# EAGLE design WIFI V 1.0 (EAGLE 7.6.0)
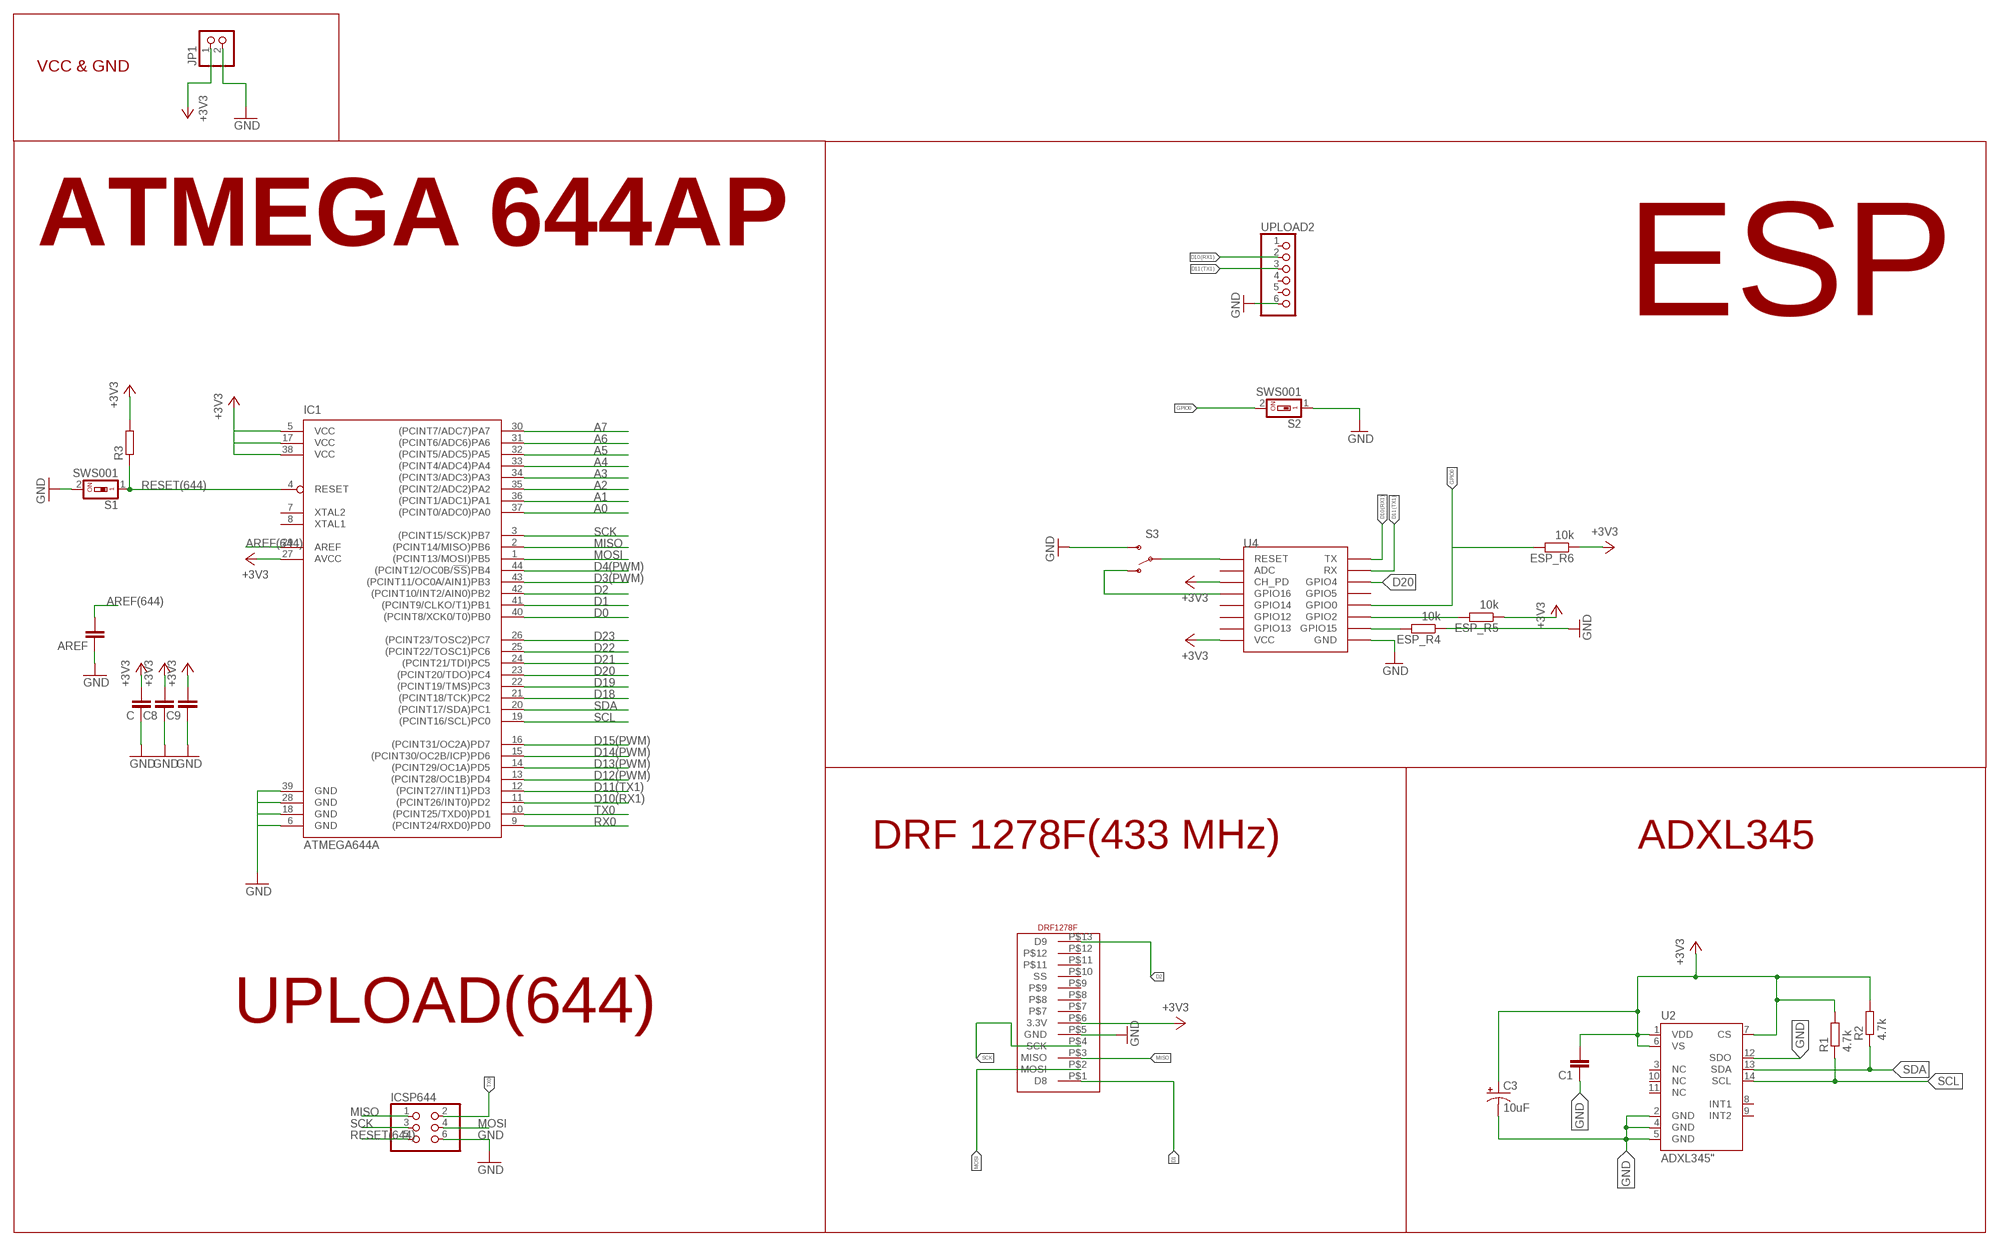
[diagram p0: schematic, sheet 1]

## Parts
AREF  100nF  C-EUC0805  [C0805]
C  22 uF  C-EUC0805  [C0805]
C1  0.1uF  C-EUC0805  [C0805]
C3  10uF  CAP_POL1206  [EIA3216]
C8  100nF  C-EUC0805  [C0805]
C9  100nF  C-EUC0805  [C0805]
ESP_R4  10k  R-EU_R0805  [R0805]
ESP_R5  10k  R-EU_R0805  [R0805]
ESP_R6  10k  R-EU_R0805  [R0805]
IC1  ATMEGA644A  [TQFP44]
ICSP644  PINHD-2X3  [2X03]
JP1  PINHD-1X2  [1X02]
R1  4.7k  R-EU_R0805  [R0805]
R2  4.7k  R-EU_R0805  [R0805]
R3  R-EU_R0805  [R0805]
S1  SWS001  [SMS-001]
S2  SWS001  [SMS-001]
S3  SWITCH-SPDTPTH  [SWITCH-SPDT]
U2  ADXL345"  [ADXL3451:1]
U4  ESP12SMD  [ESP12-SMD]
U$1  DRF1278F  [DIP13]
UPLOAD2  PINHD-1X6  [1X06]

## Nets
+3V3: C1.2 C3.A(+) C8.2 C9.2 C.2 ESP_R5.1 ESP_R6.1 IC1.5(VCC) IC1.17(VCC) IC1.27(AVCC) IC1.38(VCC) JP1.1 R1.2 R2.2 R3.2 U2.1(VDD) U2.6(VS) U2.7(CS) U4.CH_PD U4.VCC U$1.P$6(3.3V)
A0: IC1.37((PCINT0/ADC0)PA0)
A1: IC1.36((PCINT1/ADC1)PA1)
A2: IC1.35((PCINT2/ADC2)PA2)
A3: IC1.34((PCINT3/ADC3)PA3)
A4: IC1.33((PCINT4/ADC4)PA4)
A5: IC1.32((PCINT5/ADC5)PA5)
A6: IC1.31((PCINT6/ADC6)PA6)
A7: IC1.30((PCINT7/ADC7)PA7)
AREF(644): AREF.2 IC1.29(AREF)
D0: IC1.40((PCINT8/XCK0/T0)PB0)
D1: IC1.41((PCINT9/CLKO/T1)PB1) U$1.P$1(D8)
D2: IC1.42((PCINT10/INT2/AIN0)PB2) U$1.P$13(D9)
D3(PWM): IC1.43((PCINT11/OC0A/AIN1)PB3)
D4(PWM): IC1.44((PCINT12/OC0B/!SS!)PB4)
D10(RX1): IC1.11((PCINT26/INT0)PD2) U4.TXD0(TX) UPLOAD2.2
D11(TX1): IC1.12((PCINT27/INT1)PD3) U4.RXD0(RX) UPLOAD2.3
D12(PWM): IC1.13((PCINT28/OC1B)PD4)
D13(PWM): IC1.14((PCINT29/OC1A)PD5)
D14(PWM): IC1.15((PCINT30/OC2B/ICP)PD6)
D15(PWM): IC1.16((PCINT31/OC2A)PD7)
D18: IC1.21((PCINT18/TCK)PC2)
D19: IC1.22((PCINT19/TMS)PC3)
D20: IC1.23((PCINT20/TDO)PC4) U4.GPIO4
D21: IC1.24((PCINT21/TDI)PC5)
D22: IC1.25((PCINT22/TOSC1)PC6)
D23: IC1.26((PCINT23/TOSC2)PC7)
GND: AREF.1 C1.1 C3.C(-) C8.1 C9.1 C.1 ESP_R4.1 IC1.6(GND) IC1.18(GND) IC1.28(GND) IC1.39(GND) ICSP644.6 JP1.2 S1.2 S2.1 S3.3(S) U2.2(GND) U2.4(GND) U2.5(GND) U2.12(SDO) U4.GND U$1.P$5(GND) UPLOAD2.6
GPIO0: ESP_R6.2 S2.2 U4.GPIO0
MISO: IC1.2((PCINT14/MISO)PB6) ICSP644.1 U$1.P$3(MISO)
MOSI: IC1.1((PCINT13/MOSI)PB5) ICSP644.4 U$1.P$2(MOSI)
N$3: S3.1(O) U4.GPIO16
N$4: S3.2(P) U4.RESET
N$7: ESP_R4.2 U4.GPIO15
N$9: ESP_R5.2 U4.GPIO2
RESET(644): IC1.4(RESET) ICSP644.5 R3.1 S1.1
RX0: IC1.9((PCINT24/RXD0)PD0)
SCK: IC1.3((PCINT15/SCK)PB7) ICSP644.3 U$1.P$4(SCK)
SCL: IC1.19((PCINT16/SCL)PC0) R1.1 U2.14(SCL)
SDA: IC1.20((PCINT17/SDA)PC1) R2.1 U2.13(SDA)
TX0: IC1.10((PCINT25/TXD0)PD1) ICSP644.2
Unconnected: IC1.7(XTAL2) IC1.8(XTAL1) U2.3(NC) U2.8(INT1) U2.9(INT2) U2.10(NC) U2.11(NC) U4.ADC U4.GPIO5 U4.GPIO12 U4.GPIO13 U4.GPIO14 U$1.P$7 U$1.P$8 U$1.P$9 U$1.P$10(SS) U$1.P$11 U$1.P$12 UPLOAD2.1 UPLOAD2.4 UPLOAD2.5

## Notes on the sheet
- VCC & GND
- ATMEGA 644AP
- ESP
- DRF 1278F(433 MHz) | ADXL345
- UPLOAD(644)

## Library data of the parts
AREF C C1 C8 C9 = rcl:C-EU: CAPACITOR, European symbol
C3 = SparkFun:CAP_POL: Capacitor Polarized These are standard SMD and PTH capacitors. Normally 10uF, 47uF, and 100uF in electrolytic and tantalum varieties. Always verify the external diameter of the through hole cap, it varies with capacity, voltage, and manufacturer. The EIA devices should be standard.
ESP_R4-ESP_R6 R1-R3 = resistor:R-EU_: RESISTOR, European symbol
IC1 = atmel:ATMEGA644: 8-bit Microcontroller with 64K Bytes In-System Programmable Flash Source: http://www.atmel.com/dyn/resources/prod_documents/doc2593.pdf; MPN: ATMEGA644PV-10AU; OC_FARNELL: 1455123; OC_NEWARK: 58M3748
ICSP644 = pinhead:PINHD-2X3: PIN HEADER
JP1 = pinhead:PINHD-1X2: PIN HEADER
S1 S2 = smd-special:SWS001: SMD Dip Switch 1 pol.
S3 = SparkFun-Electromechanical:SWITCH-SPDT: SPDT Switch Simple slide switch, Spark Fun Electronics SKU : COM-00102 DPDT SMT slide switch, AYZ0202, SWCH-08179; PROD_ID: SWCH-08261
U2 = SparkFun-Sensors:ADXL345: 3-axis SPI/I2C 2/4/8/16g accelerometer; PROD_ID: IC-09097
U4 = esp8266modules:ESP12: ESP8266 Wifi module 12
U$1 = small_header:DRF1278F
UPLOAD2 = pinhead:PINHD-1X6: PIN HEADER

## Board
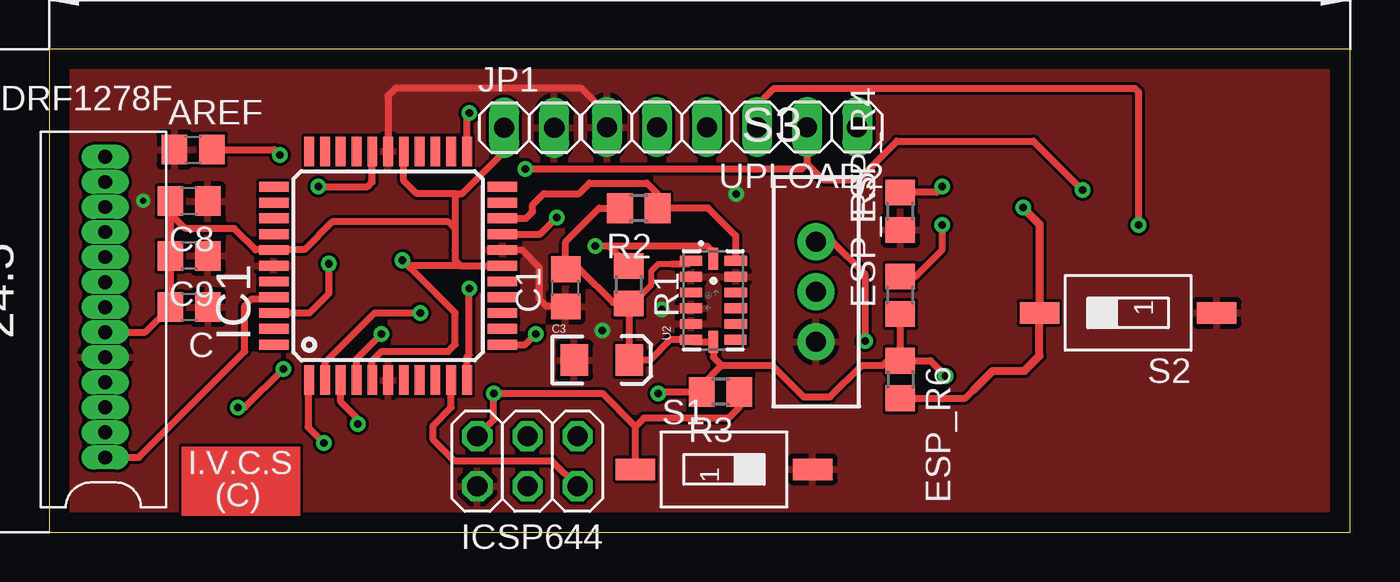
[diagram p1: board, top side]
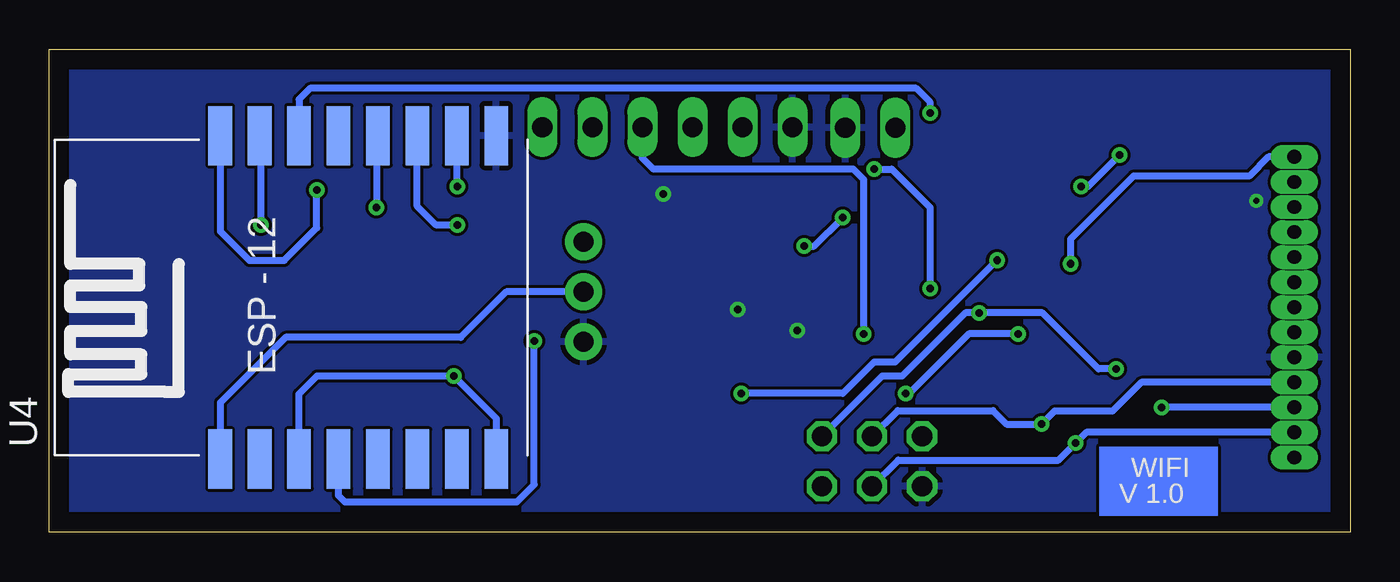
[diagram p2: board, bottom side, seen from below]

Size 66 x 24.5 mm. Coordinates in mm from the lower left corner, seen from the top.
Outline: 0,0 66,0 66,24.5 0,24.5 0,0
Copper layers (1*16): Top 0.035mm / dielectric 1.5mm / Bottom 0.035mm
Design rules "default *": minimum track width 9mil, minimum drill 11mil, track to track 6mil, track to pad 6mil, pad to pad 6mil, via to via 6mil, smd to smd 6mil, copper to edge 40mil, drill to drill 8mil, minimum pad ring 10mil, minimum via ring 8mil, stop-mask expansion 4mil, vias tented up to drill 0mil, thermal gap 10mil

### Footprints (pad centres in the part's own frame; a part is rotated, then mirrored left to right if it is on the bottom)
C0805 = smd 1.3 x 1.5: 1 -0.95,0; 2 0.95,0
EIA3216 = smd 1.4 x 1.6: A 1.4,0; C -1.4,0
R0805 = smd 1.3 x 1.5: 1 -0.95,0; 2 0.95,0
TQFP44 = smd 1.5 x 0.5: 1 -5.8,4; 2 -5.8,3.2; 3 -5.8,2.4; 4 -5.8,1.6; 5 -5.8,0.8; 6 -5.8,0; 7 -5.8,-0.8; 8 -5.8,-1.6; 9 -5.8,-2.4; 10 -5.8,-3.2; 11 -5.8,-4; 23 5.8,-4; 24 5.8,-3.2; 25 5.8,-2.4; 26 5.8,-1.6; 27 5.8,-0.8; 28 5.8,0; 29 5.8,0.8; 30 5.8,1.6; 31 5.8,2.4; 32 5.8,3.2; 33 5.8,4 | smd 0.5 x 1.5: 12 -4,-5.8; 13 -3.2,-5.8; 14 -2.4,-5.8; 15 -1.6,-5.8; 16 -0.8,-5.8; 17 0,-5.8; 18 0.8,-5.8; 19 1.6,-5.8; 20 2.4,-5.8; 21 3.2,-5.8; 22 4,-5.8; 34 4,5.8; 35 3.2,5.8; 36 2.4,5.8; 37 1.6,5.8; 38 0.8,5.8; 39 0,5.8; 40 -0.8,5.8; 41 -1.6,5.8; 42 -2.4,5.8; 43 -3.2,5.8; 44 -4,5.8
2X03 = drill 1.016 octagon: 1 -2.54,-1.27; 2 -2.54,1.27; 3 0,-1.27; 4 0,1.27; 5 2.54,-1.27; 6 2.54,1.27
1X02 = drill 1.016 long: 1 -1.27,0; 2 1.27,0
SMS-001 = smd 1.092 x 2.007: 1 0,-4.496; 2 0,4.496
SWITCH-SPDT = drill 1.016 pad 1.88: 1 0,2.54; 2 0,0; 3 0,-2.54
ADXL3451:1 = smd 0.5 x 1.124: 1 2,1.138; 2 1.2,1.138; 3 0.4,1.138; 4 -0.4,1.138; 5 -1.2,1.138; 6 -2,1.138; 8 -2,-1.13; 9 -1.2,-1.138; 10 -0.4,-1.138; 11 0.4,-1.138; 12 1.2,-1.138; 13 2,-1.138 | smd 1.124 x 0.5: 7 -2.1,0; 14 2.1,0
ESP12-SMD = smd 3 x 1.2: ADC -8.3,3.8; CH_PD -8.3,1.8; GND 8.1,-8.2; GPIO0 8.1,-2.2; GPIO2 8.1,-4.2; GPIO4 8.1,1.8; GPIO5 8.1,-0.2; GPIO12 -8.3,-4.2; GPIO13 -8.3,-6.2; GPIO14 -8.3,-2.2; GPIO15 8.1,-6.2; GPIO16 -8.3,-0.2; RESET -8.3,5.8; RXD0 8.1,3.8; TXD0 8.1,5.8; VCC -8.3,-8.2
DIP13 = drill 0.7 long: P$1 -2,0; P$2 -2,-1.27; P$3 -2,-2.54; P$4 -2,-3.81; P$5 -2,-5.08; P$6 -2,-6.35; P$7 -2,-7.62; P$8 -2,-8.89; P$9 -2,-10.16; P$10 -2,-11.43; P$11 -2,-12.7; P$12 -2,-13.97; P$13 -2,-15.24
1X06 = drill 1.016 long: 1 -6.35,0; 2 -3.81,0; 3 -1.27,0; 4 1.27,0; 5 3.81,0; 6 6.35,0

### Placement (x,y rotation side)
AREF  7.3,19.42 0 top
C  7.1,11.43 180 top
C1  26.19,12.4 90 top
C3  28.03,8.74 0 top
C8  7.1,16.8 180 top
C9  7.1,14.02 180 top
ESP_R4  43.17,16.29 90 top
ESP_R5  43.17,12.02 90 top
ESP_R6  43.17,7.76 270 top
IC1  17.19,13.52 90 top
ICSP644  24.26,3.6 180 top
JP1  24.35,20.52 0 top
R1  29.4,12.57 270 top
R2  29.9,16.44 180 top
R3  34.06,7.13 180 top
S1  34.23,3.19 270 top
S2  54.73,11.13 90 top
S3  38.9,12.2 0 top
U2  33.69,11.77 90 top
U4  51.53,12.02 90 bottom
U$1  0.84,3.8 180 top
UPLOAD2  34.64,20.56 180 top

### Tracks (layer width: path | path; a pad name or v marks a point on that pad's centre or on a via)
+3V3  (via drill 0.38)
  Top 0.305: R1.2 29.61,11.62 30.55,12.56 30.55,13.27 30.9,13.62 31.61,13.62
  Top 0.356: 20.59,17.18 18.64,17.18 17.99,17.83 IC1.27 | 20.59,17.18 20.59,15.4 | 20.59,15.4 20.59,14.34 | 20.59,14.34 20.59,13.8 20.87,13.52 | 20.87,13.52 IC1.17 | 20.58,14.32 20.59,14.34 | U$1.P$6 4.88,10.15 C.2 C9.2 C8.2 6.15,16.16 6.9,15.4 9.39,15.4 10.47,14.32 IC1.38 11.4,14.34 12.95,14.34 14.36,15.75 20.25,15.75 20.59,15.4 | v30.9,7.04 30.98,7.13 R3.2 33.11,7.47 34.1,8.47 | 34.1,8.47 36.67,8.47 38.27,6.87 39.62,6.87 41.22,8.47 42.28,8.47 42.52,8.71 ESP_R6.1 | IC1.5 16.39,8.71 16.86,9.18 20.24,9.18 20.59,9.53 20.59,11.13 18.28,13.45 | 20.59,17.18 20.95,17.18 23.08,19.31 JP1.1 | ESP_R6.1 44.71,8.71 v45.48,7.93 | ESP_R6.1 ESP_R5.1 | 18.28,13.45 v17.92,13.8 | 20.87,13.52 18.36,13.52 18.28,13.45 | 31.61,13.62 32.4,13.62 U2.1 | 34.1,8.47 33.69,8.88 U2.7 32.65,9.67 U2.6 31.49,9.77 30.47,8.74 C3.A 29.43,11.58 R1.2 29.34,11.67 28.59,11.67 26.91,13.35 C1.2 26.19,14.73 27.9,16.44 R2.2
  Bottom 0.356: U4.VCC 43.33,5.78 v45.48,7.93 52.42,7.93 53.33,7.02 U4.CH_PD | v17.92,13.8 23.08,8.64 24.15,8.64 25.75,7.04 v30.9,7.04
AREF(644)  (via drill 0.38)
  Top 0.356: AREF.2 11.42,19.42 v11.7,19.14 | v13.66,17.54 16.15,17.54 16.39,17.78 IC1.29
  Bottom 0.356: v11.7,19.14 13.3,17.54 v13.66,17.54
D1
  Top 0.356: U$1.P$1 4.55,3.8 9.92,9.18 9.92,11.49 10.28,11.85 11.31,11.85 IC1.41
D2  (via drill 0.38)
  Top 0.356: IC1.42 11.4,11.13 13.2,11.13 14.19,12.12 v14.19,13.62
  Bottom 0.356: U$1.P$13 4.15,19.04 5.12,18.07 10.99,18.07 14.19,14.87 v14.19,13.62
D10(RX1)  (via drill 0.38)
  Top 0.356: UPLOAD2.2 38.45,18.7 | 38.45,18.7 39.26,17.89 41.04,17.89 42.99,19.85 49.93,19.85 v52.42,17.36 | 38.45,18.7 38.17,18.42 v24.15,18.42 | IC1.11 21.19,8.89 21.3,9 v21.3,12.38
  Bottom 0.356: v24.15,18.42 23.26,18.42 21.3,16.47 v21.3,12.38 | U4.TXD0 57.33,15.27 55.85,13.79 54.08,13.79 52.43,15.44 v52.43,17.35 v52.42,17.36
D11(TX1)  (via drill 0.38)
  Top 0.356: IC1.12 24.14,9.52 v24.68,10.07 | UPLOAD2.3 35.91,21.65 36.77,22.51 55.09,22.51 55.26,22.34 v55.26,15.58
  Bottom 0.356: v24.68,10.07 24.68,17.89 25.21,18.42 35.35,18.42 35.91,18.98 UPLOAD2.3 | v55.26,15.58 55.26,20.06 U4.RXD0
D20  (via drill 0.38)
  Top 0.356: IC1.23 21.19,21.16 v21.3,21.27
  Bottom 0.356: U4.GPIO4 53.33,21.96 52.77,22.51 22.01,22.51 21.3,21.8 v21.3,21.27
GND  (via drill 0.3, 0.38)
  Top 0.356: IC1.18 23.98,14.32 24.86,13.45 24.86,11.85 25.21,11.49 26.15,11.49 C1.1 | UPLOAD2.6 28.29,21.22 26.99,22.51 17.57,22.51 17.19,22.13 IC1.28
  other vias: 4.77,16.82 28.06,10.25 34.84,17.15 31.08,11.31
  pour Top: 0.18,24.37 0.18,0.18 65.75,0.18 66.25,24.37
  pour Bottom: 0.18,24.37 65.75,24.37 66.25,0.18 0.18,0.18
GPIO0  (via drill 0.38)
  Top 0.356: ESP_R6.2 46.49,6.81 46.91,7.22
  Top 0.406: v49.4,16.47 50.23,15.63 S2.2 50.23,8.95 49.47,8.19 47.87,8.19 46.91,7.22
  Bottom 0.356: U4.GPIO0 49.4,20.06 v49.4,16.47
MISO  (via drill 0.38)
  Top 0.356: v9.57,6.33 9.92,6.33 v11.88,8.29 | IC1.2 13.99,8.62 16.5,11.13 v18.81,11.13
  Bottom 0.356: U$1.P$3 9.56,6.34 v9.57,6.33 | ICSP644.1 23.73,7.93 22.73,7.93 19.52,11.13 v18.81,11.13 15.61,11.13 12.77,8.29 v11.88,8.29
MOSI  (via drill 0.38)
  Top 0.356: IC1.1 13.12,7.66 13.12,5.34 v13.94,4.53
  Bottom 0.356: ICSP644.4 22.92,3.67 14.8,3.67 v13.94,4.53 13.39,5.07 U$1.P$2
N$3  (via drill 0.38)
  Top 0.356: v41.39,9.71 41.39,13.09 39.74,14.74 S3.1
  Bottom 0.356: v41.39,9.71 41.39,2.42 42.28,1.53 50.99,1.53 51.33,1.87 U4.GPIO16
N$4
  Bottom 0.356: S3.2 42.82,12.2 45.13,9.89 54.02,9.89 57.33,6.58 U4.RESET
N$7  (via drill 0.38)
  Top 0.356: v45.31,17.54 45.01,17.24 ESP_R4.2
  Bottom 0.356: U4.GPIO15 45.33,17.56 v45.31,17.54
N$9  (via drill 0.38)
  Top 0.356: ESP_R5.2 43.94,12.97 45.31,14.34 v45.31,15.58
  Bottom 0.356: v45.31,15.58 46.37,15.58 47.33,16.54 U4.GPIO2
RESET(644)  (via drill 0.38)
  Top 0.356: S1.1 29.74,5.37 | 29.74,5.37 28.06,7.04 v22.55,7.04 22.55,5.7 ICSP644.5 | 15.61,7.75 IC1.4 15.59,8.8 v16.86,10.07 | R3.1 35.01,6.35 34.46,5.8 30.17,5.8 29.74,5.37
  Bottom 0.356: 22.37,6.87 v22.55,7.04 22.37,7.04 19.35,10.07 v16.86,10.07
SCK  (via drill 0.38)
  Top 0.356: IC1.3 14.79,6.62 15.66,5.75 v15.66,5.5
  Bottom 0.356: ICSP644.3 22.95,6.18 18.13,6.18 17.44,5.5 v15.66,5.5 15,6.16 12.06,6.16 10.6,7.61 U$1.P$4
SCL  (via drill 0.38)
  Top 0.356: R1.1 28.4,14.51 | 28.4,14.51 v27.7,14.51 | U2.14 33.69,14.22 33.39,14.51 28.4,14.51 | IC1.19 24.91,15.12 v25.75,15.96
  Bottom 0.356: v27.7,14.51 27.2,14.51 v25.75,15.96
SDA
  Top 0.356: U2.13 34.81,13.78 34.81,15.05 33.42,16.44 R2.1 30.85,17.18 30.32,17.71 27.4,17.71 26.86,17.18 25.09,17.18 24.53,16.62 24.53,16.27 24.19,15.92 IC1.20
TX0
  Top 0.356: ICSP644.2 25.51,3.62 20.57,3.62 19.47,4.71 19.47,5.42 20.39,6.33 IC1.10
(copper drawn outside any net)
  shapes: Bottom area x1, Top area x1

### Text on the board
tPlace: I.V.C.S | (C)
bPlace: WIFI | V 1.0